# EAGLE design dfp1 (EAGLE 9.6.2)
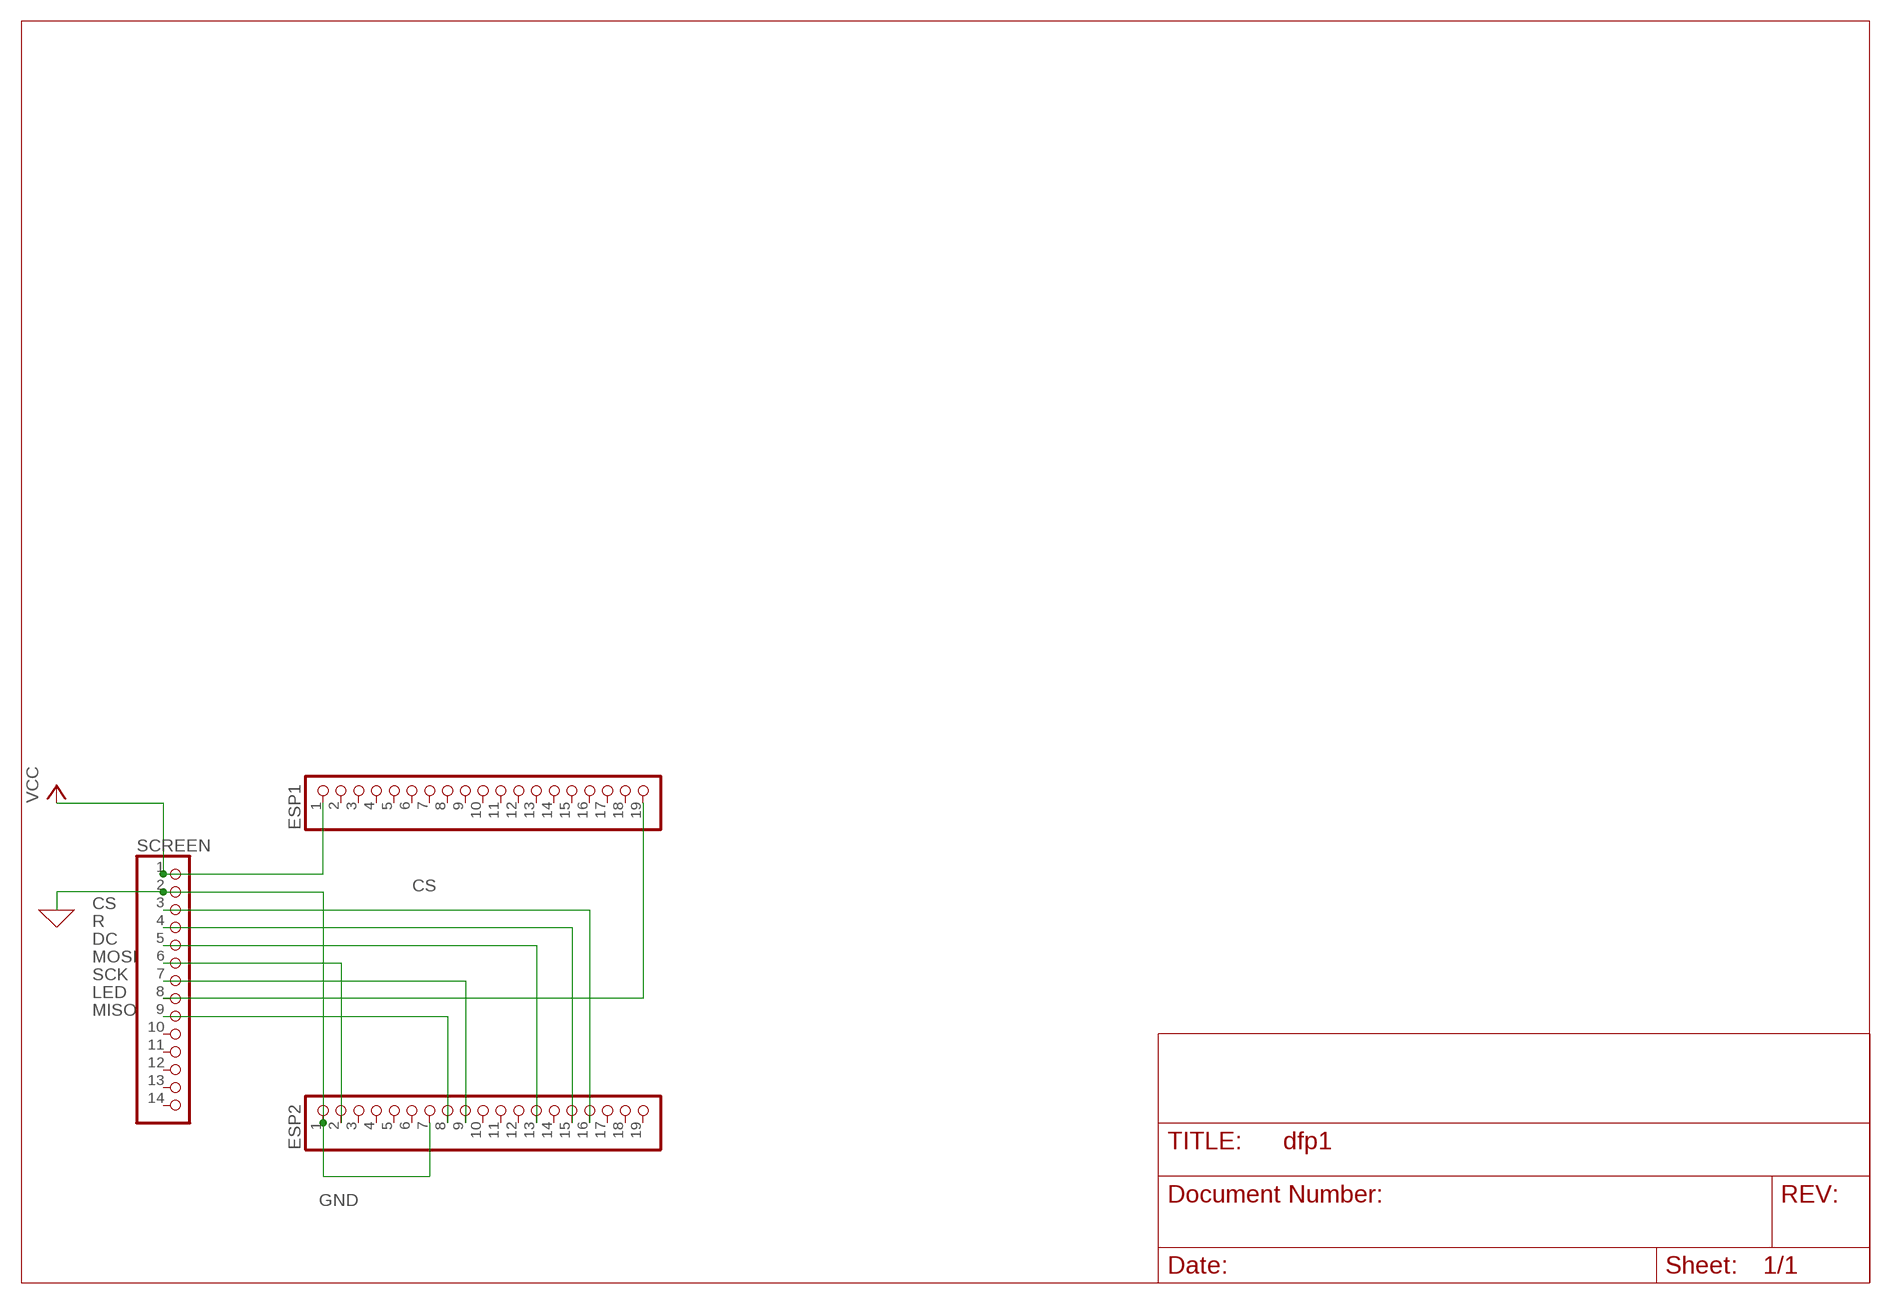
[diagram p0: schematic, sheet 1]

## Parts
ESP1  PINHD-1X19  [1X19]
ESP2  PINHD-1X19  [1X19]
SCREEN  PINHD-1X14  [1X14]

## Nets
CS: ESP2.16 SCREEN.3
DC: ESP2.13 SCREEN.5
GND [POWER]: ESP2.1 ESP2.7 SCREEN.2
LED: ESP1.19 SCREEN.8
MISO: ESP2.8 SCREEN.9
MOSI: ESP2.2 SCREEN.6
R: ESP2.15 SCREEN.4
SCK: ESP2.9 SCREEN.7
VCC [POWER]: ESP1.1 SCREEN.1
Unconnected: ESP1.2 ESP1.3 ESP1.4 ESP1.5 ESP1.6 ESP1.7 ESP1.8 ESP1.9 ESP1.10 ESP1.11 ESP1.12 ESP1.13 ESP1.14 ESP1.15 ESP1.16 ESP1.17 ESP1.18 ESP2.3 ESP2.4 ESP2.5 ESP2.6 ESP2.10 ESP2.11 ESP2.12 ESP2.14 ESP2.17 ESP2.18 ESP2.19 SCREEN.10 SCREEN.11 SCREEN.12 SCREEN.13 SCREEN.14

## Library data of the parts
ESP1 ESP2 = pinhead:PINHD-1X19: PIN HEADER
SCREEN = pinhead:PINHD-1X14: PIN HEADER

## Net classes
0 default: width 0.381 mm, clearance 0.205 mm
1 POWER: width 0.457 mm, clearance 0.205 mm to class 0, clearance 0.205 mm

## Board
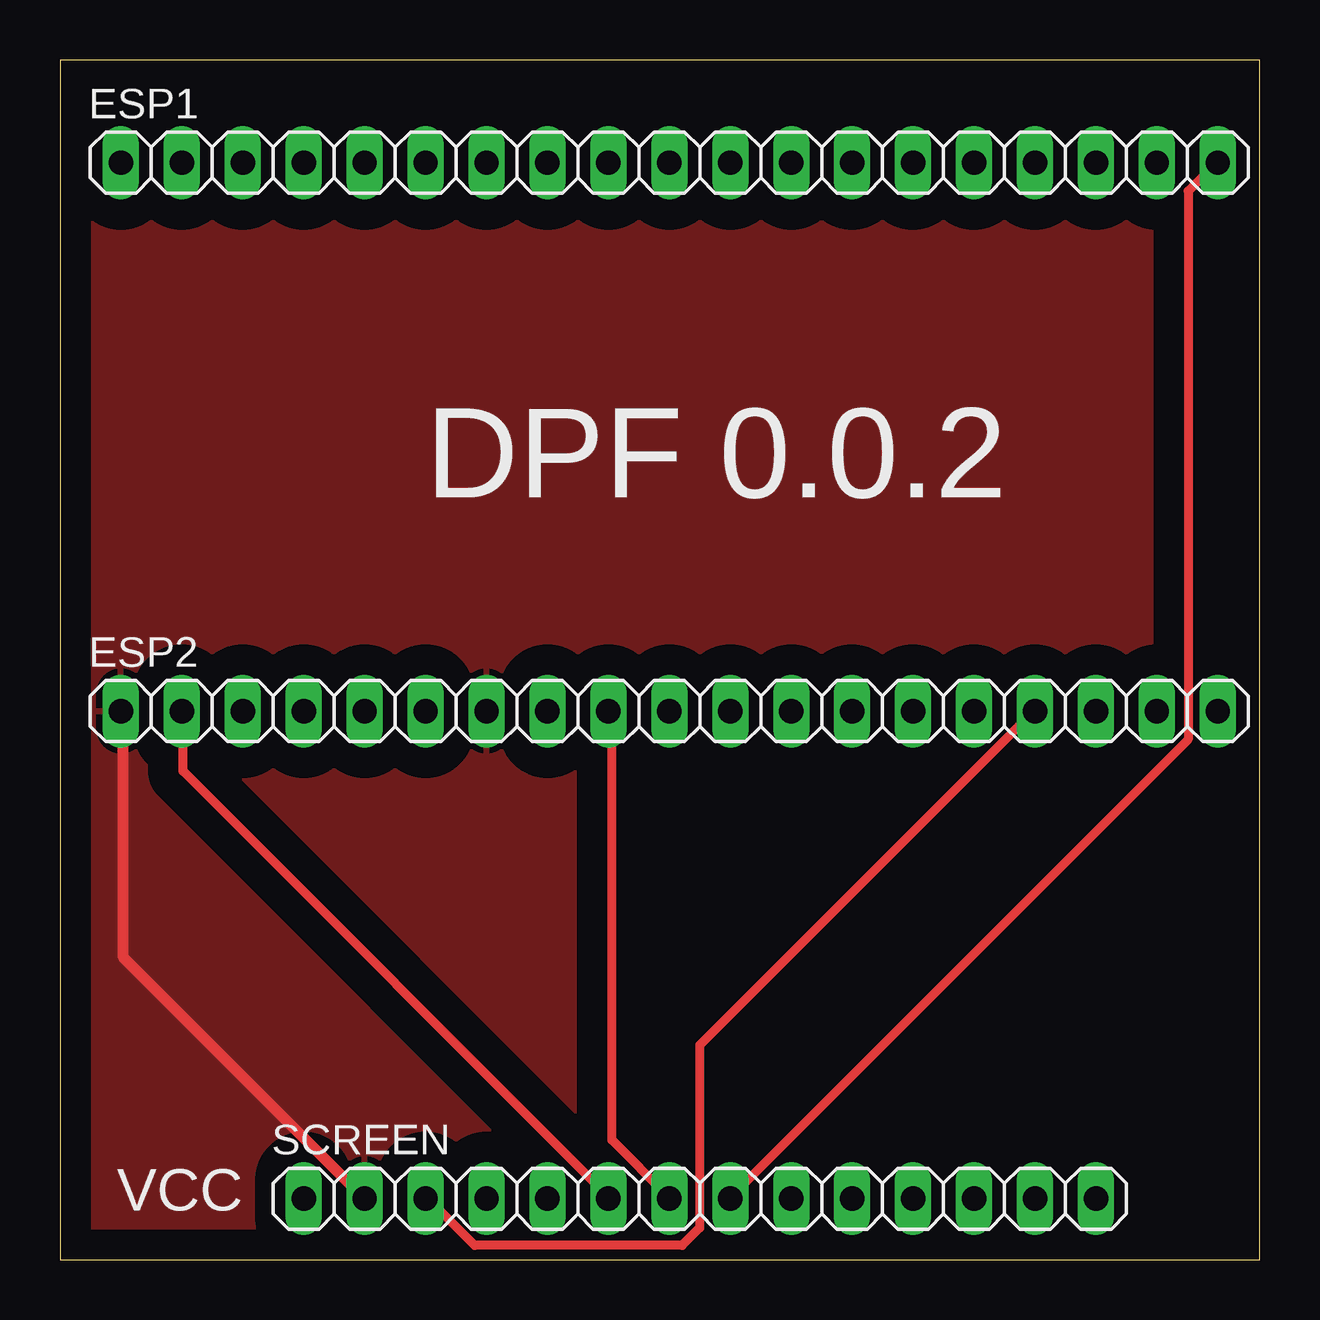
[diagram p1: board, top side]
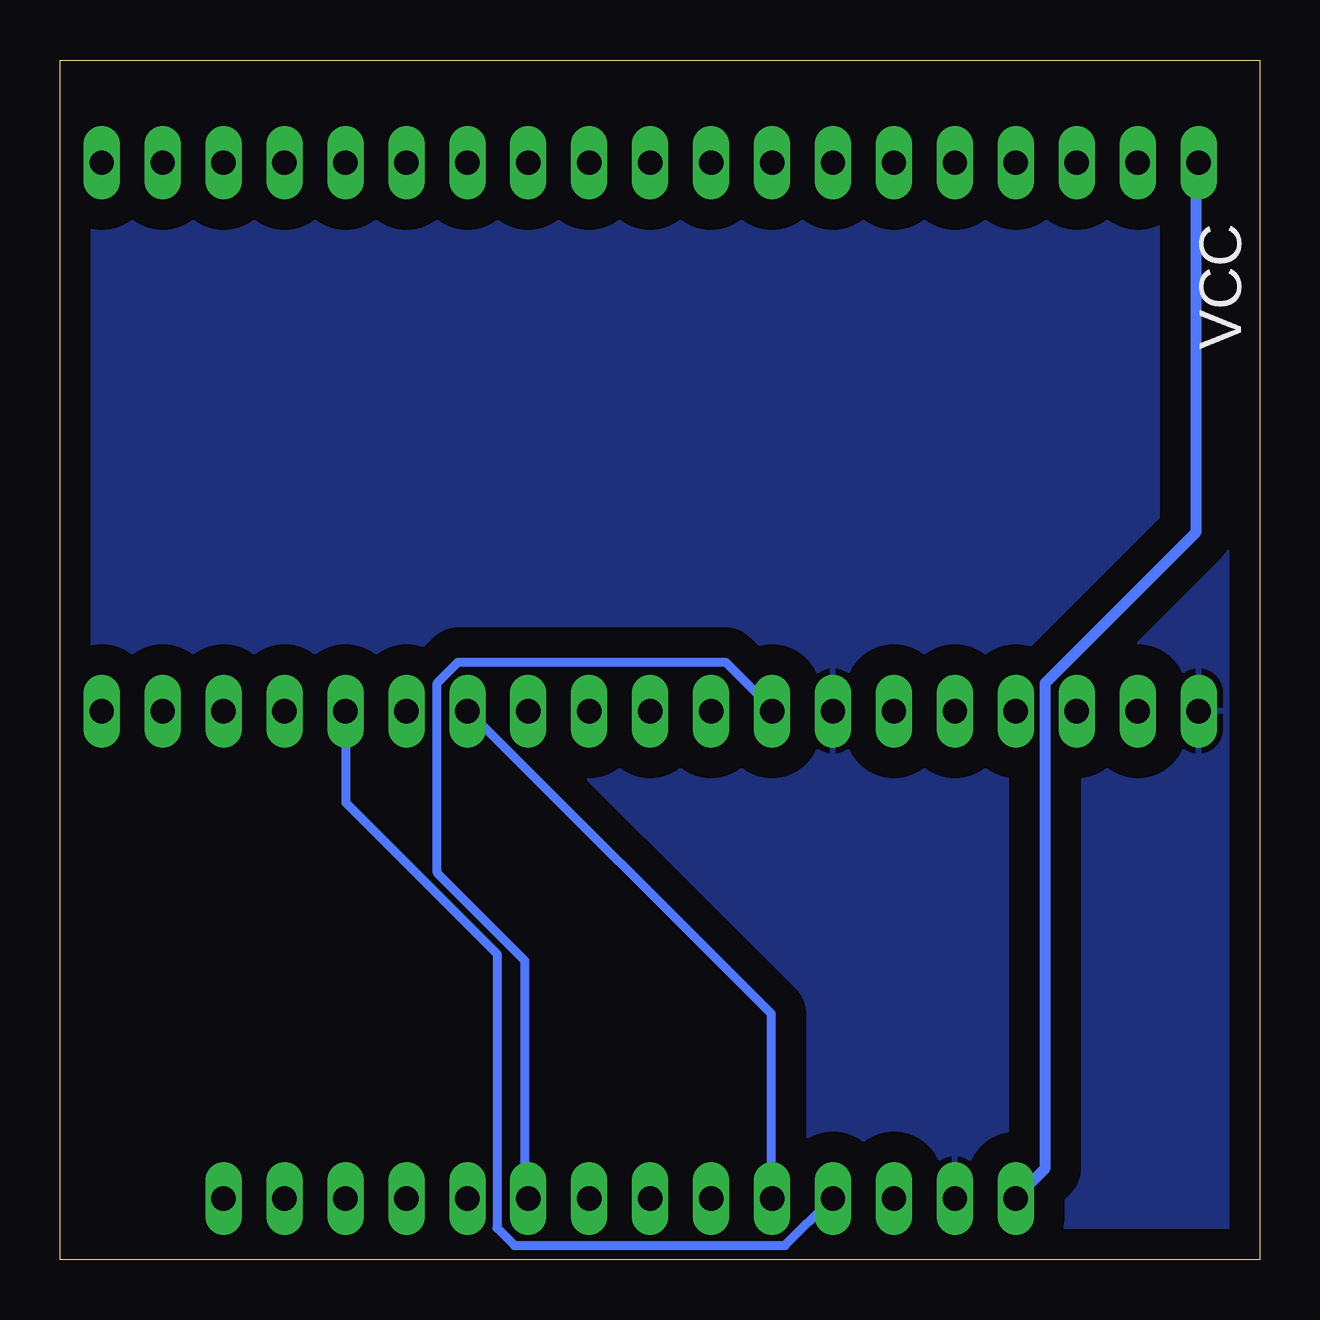
[diagram p2: board, bottom side, seen from below]

Size 50 x 50 mm. Coordinates in mm from the lower left corner, seen from the top.
Outline: 0,0 50,0 50,50 0,50 0,0
Copper layers (1*16): Top 0.035mm / dielectric 1.5mm / Bottom 0.035mm
Design rules "dirt_cheap_dirty_boards.v1.1": minimum track width 6mil, minimum drill 12mil, track to track 6mil, track to pad 6mil, pad to pad 6mil, via to via 6mil, smd to smd 0mil, copper to edge 10mil, drill to drill 10mil, minimum pad ring 10mil, minimum via ring 6mil, stop-mask expansion 2mil, vias tented up to drill 25mil, thermal gap 10mil

### Footprints (pad centres in the part's own frame; a part is rotated, then mirrored left to right if it is on the bottom)
1X19 = drill 1.016 long: 1 -22.86,0; 2 -20.32,0; 3 -17.78,0; 4 -15.24,0; 5 -12.7,0; 6 -10.16,0; 7 -7.62,0; 8 -5.08,0; 9 -2.54,0; 10 0,0; 11 2.54,0; 12 5.08,0; 13 7.62,0; 14 10.16,0; 15 12.7,0; 16 15.24,0; 17 17.78,0; 18 20.32,0; 19 22.86,0
1X14 = drill 1.016 long: 1 -16.51,0; 2 -13.97,0; 3 -11.43,0; 4 -8.89,0; 5 -6.35,0; 6 -3.81,0; 7 -1.27,0; 8 1.27,0; 9 3.81,0; 10 6.35,0; 11 8.89,0; 12 11.43,0; 13 13.97,0; 14 16.51,0

### Placement (x,y rotation side)
ESP1  25.4,45.72 0 top
ESP2  25.4,22.86 0 top
SCREEN  26.67,2.54 0 top

### Tracks (layer width: path | path; a pad name or v marks a point on that pad's centre or on a via)
CS
  Top 0.381: SCREEN.3 15.38,2.49 17.29,0.59 25.93,0.59 26.66,1.32 26.66,8.94 40.58,22.85 ESP2.16
DC
  Bottom 0.381: SCREEN.5 20.36,2.64 20.36,10.26 32.96,22.85 ESP2.13
GND
  Top 0.457: ESP2.1 2.64,22.85 2.64,12.6 12.6,2.64 SCREEN.2
  pour Top (isolate 1.27): 1.27,49.53 49.53,49.53 49.53,1.27 1.27,1.27
  pour Bottom (isolate 1.27): 1.27,49.53 1.27,1.27 49.53,1.27 49.53,49.53
LED
  Top 0.381: SCREEN.8 27.98,2.64 47.03,21.68 47.03,44.54 48.2,45.71 ESP1.19
MISO
  Bottom 0.381: ESP2.8 20.36,23 22.27,24.91 33.4,24.91 34.28,24.03 34.28,16.11 30.62,12.45 30.62,2.64 SCREEN.9
MOSI
  Top 0.381: ESP2.2 5.13,22.85 5.13,20.36 22.85,2.64 SCREEN.6
R
  Bottom 0.381: SCREEN.4 17.87,2.49 19.78,0.59 31.06,0.59 31.79,1.32 31.79,12.74 38.09,19.05 ESP2.15
SCK
  Top 0.381: ESP2.9 23,22.85 23,4.98 25.34,2.64 SCREEN.7
VCC
  Bottom 0.457: ESP1.1 2.64,45.71 2.64,30.33 8.94,24.03 8.94,3.81 10.11,2.64 SCREEN.1

### Text on the board
tNames: DPF 0.0.2 | VCC
bNames: VCC